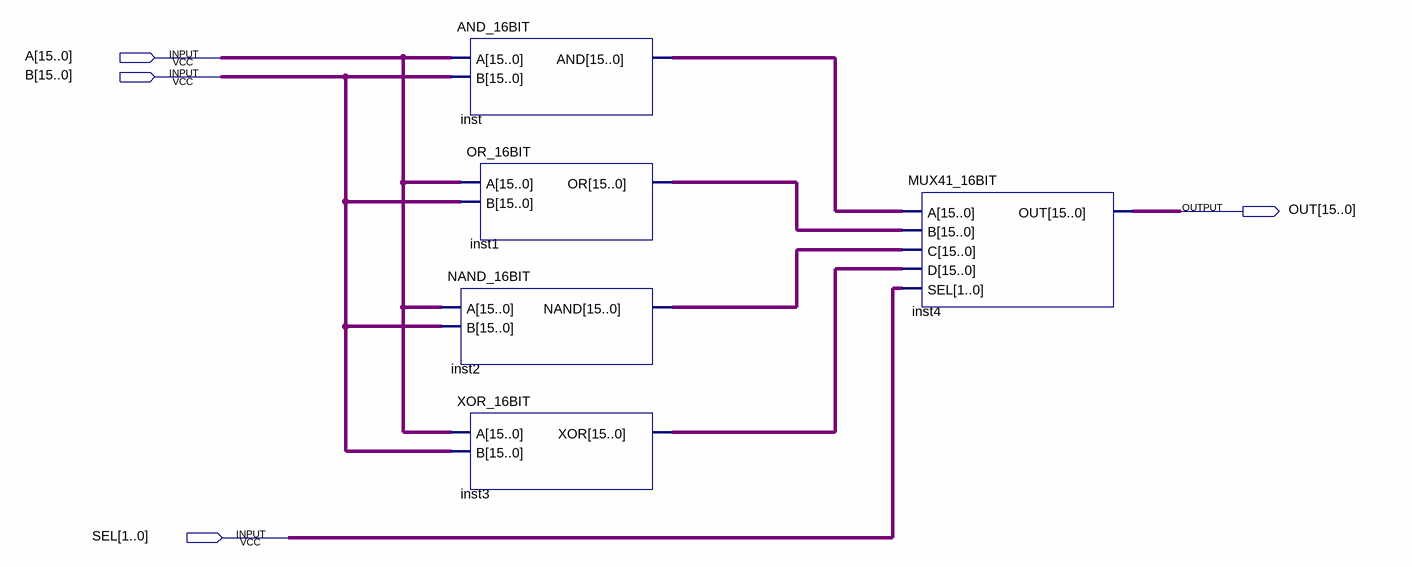
[diagram p0: schematic sheet]
// Quartus schematic LU.bdf as structural Verilog: 5 symbols, 4 pins
module LU (
  input  [15:0] A,
  input  [15:0] B,
  input  [1:0] SEL,
  output [15:0] OUT
);

  wire [15:0] inst1_or, inst2_nand, inst3_xor, inst_and;

  AND_16BIT inst (.A(A), .B(B), .AND(inst_and));
  OR_16BIT inst1 (.A(A), .B(B), .OR(inst1_or));
  NAND_16BIT inst2 (.A(A), .B(B), .NAND(inst2_nand));
  XOR_16BIT inst3 (.A(A), .B(B), .XOR(inst3_xor));
  MUX41_16BIT inst4 (.A(inst_and), .B(inst1_or), .C(inst2_nand), .D(inst3_xor), .SEL(SEL), .OUT(OUT));
endmodule
